# EasyEDA Pro project musclemap_pcb_header.eprj, board PCB1
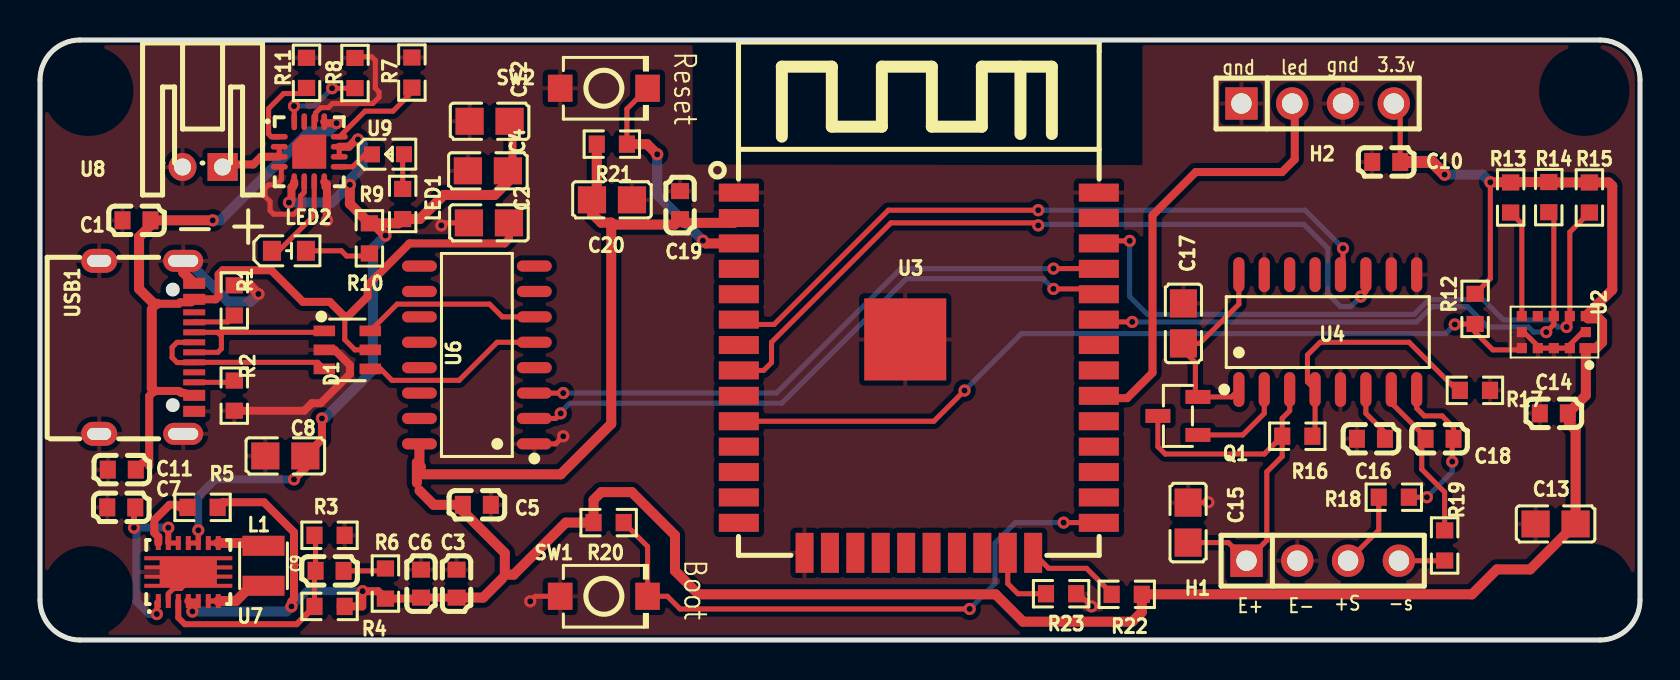
[diagram p5: board, top side]
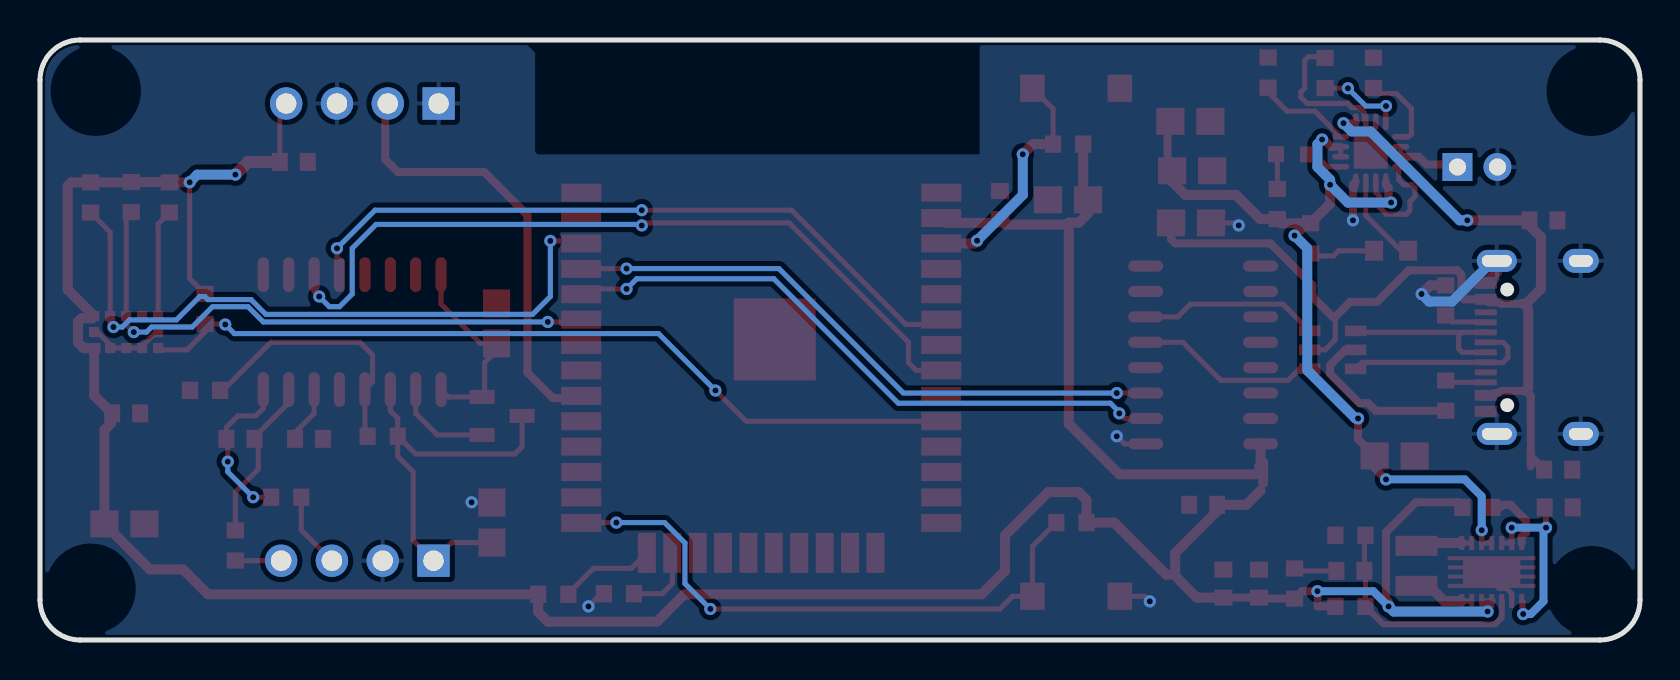
[diagram p6: board, bottom side, seen from below]

Outline 80 x 30 mm; copper layers: Top Layer, Bottom Layer. Coordinates in mm from the lower left corner of the outline.
Outline path: 0,28 0,2 arc(0.59,0.59) 2,0 78,0 arc(79.41,0.59) 80,2 80,28 arc(79.41,29.41) 78,30 2,30 arc(0.59,29.41) 0,28
Stack: Top Layer 0.035mm / Dielectric1 1.51mm FR4 er 4.5 / Bottom Layer 0.035mm

## Design rules (mm)
net D+_U: DP1
net D-_U: DP1
template: JLCPCB Capability(Two Layers Board)
spacing copperThickness1oz (default): track to track 0.102, other pairs 0.152 to 0.3
spacing copperThickness2oz: track to track 0.203, other pairs 0.152 to 0.3
track width copperThickness1oz (default): min 0.127, default 0.254, max 2.54
track width copperThickness2oz: min 0.203, default 0.254, max 2.54
differential pair differentialPair (default): width min 0.127, default 0.254, max 2.54; gap min 0.152, default 0.152
via viaSize (default): diameter min 0.5, default 0.61, max 10; hole min 0.3, default 0.305, max 6.3

## Placement (name value [footprint] x y rotation side)
C1  100nF  [C0603]  4.83 20.98 0 top
C2  10uF  [C0805]  22.45 20.86 0 top
C3  22uF  [C0603]  20.83 2.82 270 top
C4  10uF  [C0805]  22.4 23.46 180 top
C5  22uF  [C0603]  21.84 6.76 180 top
C6  22uF  [C0603]  19.05 2.82 270 top
C7  100nF  [C0603]  4.06 6.63 180 top
C8  10uF  [C0805]  12.27 9.2 180 top
C9  4.7pF  [C0603]  14.48 3.46 0 top
C10  100nF  [C0603]  67.31 23.9 180 top
C11  1uF  [C0603]  4.09 8.52 0 top
C12  4.7uF  [C0805]  22.48 25.94 0 top
C13  4.7uF  [C0805]  75.78 5.8 0 top
C14  100nF  [C0603]  75.69 11.33 0 top
C15  10uF  [C0805]  57.4 5.87 270 top
C16  100nF  [C0603]  66.55 10.06 180 top
C17  10uF  [C0805]  57.17 15.83 90 top
C18  100nF  [C0603]  69.98 10.06 0 top
C19  100nF  [C0603]  32 21.74 90 top
C20  10uF  [C0805]  28.6 22.01 0 top
D1  USBLC6-2SC6  [SOT-23-6_L2.9-W1.6-P0.95-LS2.8-BL]  15.37 14.51 270 top
H1  HX PH254-01-04-Z-L11.5 straight pin header  [HDR-TH_4P-HX-PH254-01-04-Z-L11.5]  64.13 3.97 0 top
H2  HX PH254-01-04-Z-L11.5 straight pin header  [HDR-TH_4P-HX-PH254-01-04-Z-L11.5]  63.88 26.83 0 top
L1  1.5uH  [IND-SMD_L2.5-W2.0_MEKK2520TR47M]  11.18 3.71 90 top
LED1  XL-1608SURC-06  [LED0603-RD_RED]  17.4 24.28 0 top
LED2  YLED0603B  [LED0603-FD]  12.45 19.46 180 top
Q1  BC807-40,215  [SOT-23-3_L2.9-W1.3-P1.90-LS2.4-BR]  56.9 11.2 0 top
R1  5.1kΩ  [R0603]  9.72 16.98 270 top
R2  5.1kΩ  [R0603]  9.71 12.22 90 top
R3  180kΩ  [R0603]  14.48 5.23 180 top
R4  1MΩ  [R0603]  14.48 1.68 0 top
R5  1MΩ  [R0603]  8.13 6.63 0 top
R6  68kΩ  [R0603]  17.27 2.82 270 top
R7  1.18kΩ  [R0603]  18.59 28.37 270 top
R8  1.13kΩ  [R0603]  15.75 28.35 270 top
R9  1kΩ  [R0603]  18.13 21.8 270 top
R10  1kΩ  [R0603]  16.47 20.08 90 top
R11  10kΩ  [R0603]  13.33 28.36 270 top
R12  3.6kΩ  [R0603]  71.75 16.56 90 top
R13  3.6kΩ  [R0603]  73.53 22.13 90 top
R14  3.6kΩ  [R0603]  75.44 22.14 90 top
R15  3.6kΩ  [R0603]  77.47 22.13 90 top
R16  20kΩ  [R0603]  62.87 10.19 180 top
R17  8.2kΩ  [R0603]  71.75 12.48 180 top
R18  100Ω  [R0603]  67.69 7.14 180 top
R19  100Ω  [R0603]  70.23 4.73 270 top
R20  10kΩ  [R0603]  28.43 5.87 180 top
R21  10kΩ  [R0603]  28.59 24.79 0 top
R22  10kΩ  [R0603]  54.34 2.28 0 top
R23  10kΩ  [R0603]  51.05 2.31 180 top
SW1  TS-1088-AR02016  [SW-SMD_L3.9-W3.0-P4.45]  28.19 2.19 0 top
SW2  TS-1088-AR02016  [SW-SMD_L3.9-W3.0-P4.45]  28.19 27.59 0 top
U2  VL53L4CDV0DH/1  [LGA-12_L4.4-W2.4_VL53L0X]  75.69 15.39 0 top
U3  ESP32-WROOM-32-N4  [WIFIM-SMD_ESP32-WROOM-32-N4]  43.94 13.36 0 top
U4  HX711  [SOP-16_L10.0-W3.9-P1.27-LS6.0-BL]  64.39 15.39 0 top
U6  CH340C  [SOP-16_L10.0-W3.9-P1.27-LS6.0-BL]  21.84 14.25 90 top
U7  TPS63020DSJT  [VSON-14_L4.0-W3.0-P0.50-BL-EP_TI_DSJ]  7.41 3.4 0 top
U8  S2B-PH-K-S(LF)(SN)  [CONN-TH_S2B-PH-K-S-LF-SN]  8.13 23.65 0 top
U9  BQ24075RGTR  [QFN-16_L3.0-W3.0-P0.50-TL-EP1.7]  13.46 24.41 0 top
USB1  TYPE-C 16PIN 2MD(073)  [USB-C-SMD_TYPE-C-6PIN-2MD-073]  5.33 14.63 270 top

## Footprints (pads in the part's own frame, mm; a bottom-side part is the same pattern mirrored in y, then rotated)
C0603
  rect 0.8x0.9 smd: 1(-0.7,0) 2(0.7,0)
C0805
  rect 1.41x1.35 smd: 1(-1,0) 2(1,0)
CONN-TH_S2B-PH-K-S-LF-SN
  rect 1.5x1.4 hole 0.85: 1(1,0)
  round 1.4 hole 0.85: 2(-1,0)
HDR-TH_4P-HX-PH254-01-04-Z-L11.5
  rect 1.62x1.62 hole 1.02: 1(-3.81,0)
  round 1.62 hole 1.02: 2(-1.27,0) 3(1.27,0) 4(3.81,0)
IND-SMD_L2.5-W2.0_MEKK2520TR47M
  rect 1x2.1 smd: 1(1,0) 2(-1,0)
LED0603-FD
  rect 0.9x1 smd: 1(-0.85,0) 2(0.85,0)
LED0603-RD_RED
  rect 0.8x0.8 smd: 1(-0.799,-0.004) 2(0.799,0.004)
LGA-12_L4.4-W2.4_VL53L0X
  custom 0.635x0.508 smd: 1(1.6,-0.8)
  rect 0.508x0.508 smd: 2(0.8,-0.8) 3(0,-0.8) 4(-0.8,-0.8) 5(-1.6,-0.8) 6(-1.6,0) 7(-1.6,0.8) 8(-0.8,0.8) 9(0,0.8) 10(0.8,0.8) 11(1.6,0.8) 12(1.6,0)
QFN-16_L3.0-W3.0-P0.50-TL-EP1.7
  oval 0.85x0.28 smd: 1(-1.5,0.75) 2(-1.5,0.25) 3(-1.5,-0.25) 4(-1.5,-0.75) 9(1.5,-0.75) 10(1.5,-0.25) 11(1.5,0.25) 12(1.5,0.75)
  oval 0.28x0.85 smd: 5(-0.75,-1.5) 6(-0.25,-1.5) 7(0.25,-1.5) 8(0.75,-1.5) 13(0.75,1.5) 14(0.25,1.5) 15(-0.25,1.5) 16(-0.75,1.5)
  custom 1.7x1.7 smd: 17(0,0)
R0603
  rect 0.806x0.864 smd: 1(-0.753,0) 2(0.753,0)
SOP-16_L10.0-W3.9-P1.27-LS6.0-BL
  oval 0.56x1.745 smd: 1(-4.445,-2.873) 2(-3.175,-2.873) 3(-1.905,-2.873) 4(-0.635,-2.873) 5(0.635,-2.873) 6(1.905,-2.873) 7(3.175,-2.873) 8(4.445,-2.873) 9(4.445,2.873) 10(3.175,2.873) 11(1.905,2.873) 12(0.635,2.873) 13(-0.635,2.873) 14(-1.905,2.873) 15(-3.175,2.873) 16(-4.445,2.873)
SOT-23-3_L2.9-W1.3-P1.90-LS2.4-BR
  rect 1.25x0.7 smd: 1(1,-0.95) 2(1,0.95) 3(-1,0)
SOT-23-6_L2.9-W1.6-P0.95-LS2.8-BL
  rect 0.532x1.072 smd: 1(-0.95,-1.149) 2(0,-1.149) 3(0.95,-1.149) 4(0.95,1.149) 5(0,1.149) 6(-0.95,1.149)
SW-SMD_L3.9-W3.0-P4.45
  rect 1.23x1.36 smd: 1(-2.185,0) 2(2.185,0)
USB-C-SMD_TYPE-C-6PIN-2MD-073
  rect 0.55x1.1 smd: 1(-3.2,2.375) 2(-2.4,2.375) 11(2.4,2.375) 12(3.2,2.375)
  rect 0.3x1.1 smd: 3(-1.75,2.375) 4(-1.25,2.375) 5(-0.75,2.375) 6(-0.25,2.375) 7(0.25,2.375) 8(0.75,2.375) 9(1.25,2.375) 10(1.75,2.375)
  oval 1.1x2 hole 0.6x1.5: 13(-4.325,1.825) 14(4.325,1.825)
  oval 1.2x1.8 hole 0.6x1.2: 13(-4.325,-2.375) 14(4.325,-2.375)
VSON-14_L4.0-W3.0-P0.50-BL-EP_TI_DSJ
  rect 0.25x0.7 smd: 1(-1.5,-1.45) 2(-1,-1.45) 3(-0.5,-1.45) 4(0,-1.45) 5(0.5,-1.45) 6(1,-1.45) 7(1.5,-1.45) 8(1.5,1.45) 9(1,1.45) 10(0.5,1.45) 11(0,1.45) 12(-0.5,1.45) 13(-1,1.45) 14(-1.5,1.45)
  custom 4.4x1.58 smd: 15(0,0)
WIFIM-SMD_ESP32-WROOM-32-N4
  rect 2x0.9 smd: 1(-9,9.005) 2(-9,7.735) 3(-9,6.465) 4(-9,5.195) 5(-9,3.925) 6(-9,2.655) 7(-9,1.385) 8(-9,0.115) 9(-9,-1.155) 10(-9,-2.425) 11(-9,-3.695) 12(-9,-4.965) 13(-9,-6.235) 14(-9,-7.505) 25(9,-7.505) 26(9,-6.235) 27(9,-4.965) 28(9,-3.695) 29(9,-2.425) 30(9,-1.155) 31(9,0.115) 32(9,1.385) 33(9,2.655) 34(9,3.925) 35(9,5.195) 36(9,6.465) 37(9,7.735) 38(9,9.005)
  rect 0.9x2 smd: 15(-5.715,-9.005) 16(-4.445,-9.005) 17(-3.175,-9.005) 18(-1.905,-9.005) 19(-0.635,-9.005) 20(0.635,-9.005) 21(1.905,-9.005) 22(3.175,-9.005) 23(4.445,-9.005) 24(5.715,-9.005)
  rect 4.1x4.1 smd: 39(-0.68,1.665)

## Nets
3.3V: C3.2 C5.2 C6.2 C10.1 C13.2 C14.2 C19.1 C20.1 H2.4 R4.2 R5.2 R6.2 R12.2 R13.2 R14.2 R15.2 R20.2 R21.1 R22.2 U2.1 U2.11 U3.2 U6.16 U7.4 U7.5
GND: C1.1 C2.1 C3.1 C4.2 C5.1 C6.1 C7.2 C8.2 C10.2 C11.1 C12.1 C13.1 C14.1 C15.1 C16.2 C17.2 C19.2 C20.2 D1.2 H1.2 H2.1 H2.3 R1.1 R2.1 R3.1 R7.1 R8.1 R11.1 R17.1 R23.1 SW1.1 SW2.1 U2.2 U2.3 U2.4 U2.6 U2.12 U3.1 U3.15 U3.38 U3.39 U4.5 U4.9 U4.10 U4.15 U6.1 U7.2 U7.15 U8.2 U9.4 U9.6 U9.8 U9.14 USB1.1 USB1.12 USB1.13 USB1.14
VBUS: C1.2 C2.2 C11.2 D1.5 U9.13 USB1.2 USB1.11
32: U3.8 U4.11
34: U3.6 U4.12
D+: D1.3 USB1.6 USB1.8
D+_U: D1.4 U6.5
D-: D1.1 USB1.5 USB1.7
D-_U: D1.6 U6.6
RX: U3.34 U6.2
SCL: R15.1 U2.10 U3.36
SDA: R14.1 U2.9 U3.33
TX: U3.35 U6.3
VOUT: C4.1 C8.1 C12.2 R9.2 R10.2 U7.10 U7.11 U9.5 U9.10 U9.11
XSHUT: R12.1 U2.5 U3.10
$1N1499: R1.2 USB1.4
$1N1538: R2.2 USB1.10
$1N2804: L1.1 U7.8 U7.9
$1N2809: L1.2 U7.6 U7.7
$1N2919: R5.1 U7.14
$1N3098: C7.1 U7.1 U7.12 U7.13
$1N3230: C9.1 R3.2 R4.1 U7.3
$1N3482: C9.2 R6.1
$1N4163: R7.2 U9.12
$1N4202: R8.2 U9.16
$1N4584: LED1.1 U9.9
$1N4586: LED1.2 R9.1
$1N4675: LED2.2 U9.7
$1N4721: LED2.1 R10.1
$1N4792: R11.2 U9.1
$1N4858: U8.1 U9.2 U9.3
$1N5175: R13.1 U2.7
$1N5467: C17.1 Q1.2 U4.1 U4.16
$1N5724: R16.1 R17.2 U4.4
$1N5741: Q1.1 U4.2
$1N5746: C15.2 H1.1 Q1.3 R16.2 U4.3
$1N5829: C16.1 U4.6
$1N6086: C18.2 R18.1 U4.8
$1N6088: C18.1 R19.1 U4.7
$1N6257: H1.3 R18.2
$1N6263: H1.4 R19.2
$1N6579: R20.1 SW1.2 U3.25
$1N6780: R21.2 SW2.2 U3.3
$1N6891: R22.1 U3.24
$1N6937: R23.2 U3.23
$1N7024: H2.2 U3.30

Pads without a net: U2 8; U3 4 5 7 9 11 12 13 14 16 17 18 19 20 21 22 26 27 28 29 31 32 37; U4 13 14; U6 4 7 8 9 10 11 12 13 14 15; U9 15 17; USB1 3 9

## Via types
v1: diameter 0.61, hole 0.305, Top Layer to Bottom Layer, 46 vias

## Routing (per net, layer and track width the routed paths; a pad name or vN(x,y) marks a point on that pad's centre or on a via; arc(x,y) is an arc through that point)
3.3V: length 170.7
  Top Layer w0.254: U7.5 U7.4 ; v1(72.52,22.89) 72.52,18.07 R12.2 ; H2.4 68.01,26.51 C10.1 ; 14.95,1.68 R4.2
  Top Layer w0.4: v1(7.62,1.42) 7.62,1.74 U7.4 ; R4.2 16.11,1.68 16.11,2.43 v1(16.13,2.44) 16.9,2.44 R6.2 19,2.07 C6.2 C3.2 ; R5.2 9.14,6.89 11.2,6.89 12.7,5.39 12.7,2.06 12.57,1.93 v1(12.57,1.68)
  Top Layer w0.5: 18.97,8.74 18.97,8.49 ; 18.97,8.74 19.05,8.66 ; 18.97,8.74 18.84,8.87 18.84,7.85 ; 18.97,8.74 U6.16 ; 28.56,20.87 28.56,10.81 26.03,8.28 19.18,8.28 ; 28.56,20.87 28.66,20.77 31.73,20.77 C19.1 32.19,20.86 34.7,20.86 U3.2 ; 28.56,20.87 28.05,20.87 27.6,21.33 C20.1 27.84,22.25 R21.1 ; C3.2 22.16,2.12 23.11,3.08 ; v1(72.52,22.89) 73.52,22.89 R13.2 73.55,22.9 75.44,22.9 75.46,22.88 R15.2 78.43,22.88 78.61,22.7 78.61,17.52 U2.11 77.4,16.08 77.93,16.08 78.1,15.9 78.1,14.89 77.81,14.59 U2.1 77.29,12.23 C14.2 76.45,11.27 76.45,10.82 76.78,10.5 C13.2 74.51,3.53 72.84,3.53 71.6,2.28 R22.2 55.09,1.4 54.61,0.92 49.15,0.92 47.78,2.28 32.92,2.28 31.75,3.46 31.75,5.23 29.59,7.39 28.07,7.39 27.68,7 27.68,5.87 26.29,5.87 23.69,3.27 23.24,3.27 23.24,4.35 21.14,6.44 C5.2 19.69,6.76 18.97,7.47
  Top Layer w0.6: v1(70.23,23.27) 69.6,23.9 C10.1
  Bottom Layer w0.4: v1(16.13,2.44) 13.34,2.44 v1(12.57,1.68)
  Bottom Layer w0.5: v1(70.23,23.27) 72.14,23.27 v1(72.52,22.89) ; v1(7.62,1.42) 12.32,1.42 v1(12.57,1.68)
GND: length 43.9
  Top Layer w0.254: U7.15 7.41,2.95 7.04,2.58 6.67,2.58 6.41,2.32 U7.2 ; U9.6 13.21,22.91 13.21,22.38 13.03,22.2 13.03,21.63 12.69,21.29 11.68,21.29 11.5,21.47 11.5,21.92 11.25,22.18 11.25,22.58 11.43,22.76 11.81,22.76 12.06,23.02 12.06,23.56 U9.4 ; C2.1 20.19,20.86 v1(20.07,20.73) ; R8.1 15.81,29.16 16.58,29.16 16.76,28.98 16.76,27.59 16.95,27.4 16.95,27.14 16.64,26.83 14.62,26.83 14.42,26.62 14.04,26.62 13.78,26.36 13.78,25.98 U9.14 ; v1(24.51,1.93) 24.77,2.19 SW1.1 ; R23.1 51.94,2.31 v1(52.58,1.68) ; U6.1 25.78,9.81 v1(26.16,10.19) ; v1(58.42,6.89) 58.4,6.87 C15.1 ; U2.6 74.19,15.39 74.93,14.66 74.93,14.63 U2.4 U2.3 U2.2 76.49,14.76 77.13,15.39 U2.12
  Top Layer w0.4: R2.1 13.21,11.46 13.59,11.84 14.03,11.84 15.49,13.3 15.49,13.74 14.73,14.51 D1.2 ; v1(14.35,20.98) 14.35,22.77 U9.8
  Top Layer w0.5: USB1.13 7.16,18.38 USB1.1 ; v1(10.92,17.3) 10.49,17.73 R1.1
  Bottom Layer w0.5: v1(10.92,17.3) 10.54,16.92 9.4,16.92 7.36,18.96 USB1.13
VBUS: length 53.2
  Top Layer w0.254: 15.24,16.16 15.24,15.01 15.75,14.51 D1.5
  Top Layer w0.4: U9.13 14.28,25.84 v1(14.83,25.84) ; C2.2 23.45,20.05 23.23,19.83 18.47,19.83 16.38,17.74 16.38,17.17 15.37,16.16 15.24,16.16 14.49,16.91 13.14,16.91 11.56,18.49 9.14,18.49 8.93,18.28 8.93,17.18 8.78,17.03 USB1.2 7.56,16.88 7.01,16.88 6.94,16.81 5.86,16.81 5.59,16.54 ; USB1.11 7.7,12.22 7.37,12.22 7.24,12.35 7.11,12.35 7.08,12.38 7.01,12.38 6.94,12.45 5.72,12.45 5.46,12.2 5.46,8.68 ; C11.2 5.33,9.06
  Top Layer w0.5: 5.59,16.54 5.59,12.58 5.72,12.45 ; v1(8.64,20.98) 5.78,20.98 4.95,20.15 4.95,17.55 5.7,16.81 5.86,16.81
  Bottom Layer w0.5: v1(8.64,20.98) 9.02,20.98 13.46,25.43 14.41,25.43 v1(14.83,25.84)
32: length 39.3
  Top Layer w0.254: U4.11 66.29,17.43 v1(66.04,17.17) ; v1(49.91,20.73) 49.78,20.86 42.55,20.86 36.58,14.89 36.58,13.87 36.18,13.48 U3.8
  Bottom Layer w0.254: v1(49.91,20.73) 49.96,20.78 63.19,20.78 64.39,19.59 64.39,17.3 65.02,16.66 65.53,16.66 v1(66.04,17.17)
34: length 34.8
  Top Layer w0.254: U4.12 65.15,18.39 v1(65.15,19.59) ; v1(49.91,21.49) 42.42,21.49 36.7,15.78 35.18,15.78 U3.6
  Bottom Layer w0.254: v1(49.91,21.49) 63.25,21.49 v1(65.15,19.59)
D+: length 9.6
  Top Layer w0.254: D1.3 13.89,13.88 USB1.8 7.7,13.87 6.86,13.87 6.6,14.12 6.6,14.63 6.85,14.88 USB1.6
D+_U: length 9.2
  Top Layer w0.254: D1.4 17.02,13.56 17.6,12.98 20.96,12.98 22.86,14.89 U6.5
D-: length 8.9
  Top Layer w0.254: USB1.5 8.88,15.38 ; 8.88,15.38 9.07,15.19 9.07,14.56 8.89,14.38 USB1.7 ; 8.88,15.38 14.14,15.38 D1.1
D-_U: length 9
  Top Layer w0.254: U6.6 23.11,16.16 22.48,16.79 17.85,16.79 D1.6
RX: length 31.5
  Top Layer w0.254: U6.2 25.78,11.08 v1(26.03,11.33) ; v1(50.67,17.55) 52.68,17.55 U3.34
  Bottom Layer w0.254: v1(50.67,17.55) 50.16,18.06 43.31,18.06 37.08,11.84 26.48,11.84 26.03,11.39 v1(26.03,11.33)
SCL: length 33.8
  Top Layer w0.254: v1(54.48,19.95) 53.07,19.95 U3.36 ; v1(76.33,15.65) 76.49,15.81 U2.10 76.49,20.39 R15.1
  Bottom Layer w0.254: v1(76.33,15.65) 75.88,15.65 75.53,16 73.18,16 72.01,17.17 71.75,17.17 71.6,17.02 69.45,17.02 68.71,16.28 55.37,16.28 54.48,17.17 v1(54.48,19.95)
SDA: length 29.5
  Top Layer w0.254: v1(54.61,15.9) 53.06,15.9 U3.33 ; v1(75.31,15.39) 75.69,15.78 U2.9 75.69,21.14 R14.1
  Bottom Layer w0.254: v1(75.31,15.39) 74.68,15.39 74.42,15.65 72.39,15.65 71.37,16.66 69.6,16.66 68.83,15.9 v1(54.61,15.9)
TX: length 30.8
  Top Layer w0.254: U3.35 52.93,18.57 v1(50.67,18.57) ; U6.3 v1(26.16,12.35)
  Bottom Layer w0.254: v1(50.67,18.57) 43.05,18.57 36.83,12.35 v1(26.16,12.35)
VOUT: length 45.1
  Top Layer w0.254: U9.10 U9.11 ; U7.11 U7.10 v1(7.91,5.49) ; R10.2 16.66,20.83
  Top Layer w0.4: v1(14.1,11.08) 14.1,10.03 C8.1 13.27,8.6 v1(12.7,8.03) ; v1(12.45,21.87) 12.57,22 12.57,22.65 12.71,22.78 U9.5 ; 23.35,25.81 23.62,25.81 23.62,23.69 C4.1 ; U9.11 15.44,24.66 15.74,24.96 15.83,24.96 v1(15.9,25.03)
  Top Layer w0.5: v1(15.49,22.76) 15.49,21.81 R10.2 ; v1(17.27,20.22) 16.66,20.83 17.92,20.83 R9.2 18.99,21.05 20.19,22.25 22.73,22.25 23.4,22.91 C4.1
  Bottom Layer w0.4: v1(12.7,8.03) 8.76,8.03 7.91,7.18 v1(7.91,5.49)
  Bottom Layer w0.5: v1(15.9,25.03) 16.13,24.79 16.13,23.65 15.49,23.02 v1(15.49,22.76) 14.61,21.87 v1(12.45,21.87) ; v1(14.1,11.08) 14.22,11.08 16.64,13.49 16.64,19.59 v1(17.27,20.22)
XSHUT: length 42
  Top Layer w0.254: U2.5 74,14.51 72.64,14.51 71.75,15.39 R12.1 70.77,15.8 v1(70.74,15.78) ; U3.10 44.69,10.94 v1(46.23,12.47)
  Bottom Layer w0.254: v1(70.74,15.78) 70.28,15.32 49.07,15.32 v1(46.23,12.47)
$1N1499: length 2.1
  Top Layer w0.254: R1.2 9.39,15.9 7.73,15.9 USB1.4
$1N1538: length 2
  Top Layer w0.254: R2.2 9.63,12.88 USB1.10
$1N2804: length 2.8
  Top Layer w0.254: U7.9 U7.8
  Top Layer w0.5: L1.1 11.04,4.85 U7.8
$1N2809: length 3.1
  Top Layer w0.254: U7.6 U7.7
  Top Layer w0.5: L1.2 11.05,2.58 10.43,2.58 9.79,1.95 U7.7
$1N2919: length 3.3
  Top Layer w0.4: R5.1 6.99,6.63 6.87,6.76 6.48,6.76 5.72,6 5.72,5.36 5.91,5.16 U7.14
$1N3098: length 9.7
  Top Layer w0.254: U7.1 5.84,1.88 v1(5.84,1.3) ; U7.12 U7.13
  Top Layer w0.3: C7.1 4.7,6.57 v1(4.7,5.62) ; U7.13 v1(6.41,5.62)
  Bottom Layer w0.4: v1(5.84,1.3) 5.46,1.3 4.83,1.93 4.83,5.49 v1(4.7,5.62) v1(6.41,5.62)
$1N3230: length 11.7
  Top Layer w0.254: R4.1 13.72,3.4 C9.1 13.78,5.18 R3.2
  Top Layer w0.3: R4.1 12.84,0.79 7.24,0.79 6.91,1.11 U7.3
$1N3482: length 2.1
  Top Layer w0.254: R6.1 17.15,3.46 C9.2
$1N4163: length 4.8
  Top Layer w0.254: R7.2 18.59,27.39 17.65,26.44 16.26,26.44 14.97,25.16 U9.12
$1N4202: length 4.2
  Top Layer w0.254: U9.16 12.71,26.69 v1(12.7,26.7) ; v1(14.61,27.59) 15.74,27.59 R8.2
  Bottom Layer w0.254: v1(12.7,26.7) 13.72,26.7 v1(14.61,27.59)
$1N4584: length 1.9
  Top Layer w0.254: LED1.1 16.25,24.28 15.63,23.66 U9.9
$1N4586: length 1.8
  Top Layer w0.254: LED1.2 18.13,24.22 R9.1
$1N4675: length 4.5
  Top Layer w0.254: U9.7 13.71,21.23 11.94,19.46 LED2.2
$1N4721: length 3.3
  Top Layer w0.254: R10.1 16.34,19.2 15.33,19.2 15.07,19.46 LED2.1
$1N4792: length 4.3
  Top Layer w0.254: U9.1 11.57,25.16 11.43,25.3 11.43,26.57 12.18,27.32 13.33,27.32 R11.2
$1N4858: length 3.6
  Top Layer w0.254: U9.3 U9.2
  Top Layer w0.4: 9,23.78 10.67,23.78 11.05,24.16 U9.3
$1N5175: length 5.4
  Top Layer w0.254: R13.1 74.09,20.81 U2.7
$1N5467: length 10.2
  Top Layer w0.254: U4.16 59.94,16.79 57.98,14.83 C17.1 57.17,14.47 57.77,13.87 57.77,12.28 Q1.2 59.58,12.15 U4.1
$1N5724: length 13.3
  Top Layer w0.254: 70.87,12.23 70.87,12.47 68.45,14.89 64.01,14.89 63.37,14.25 63.37,12.9 U4.4 63.75,10.32 R16.1
$1N5741: length 5
  Top Layer w0.254: Q1.1 60.14,10.25 61.21,11.33 U4.2
$1N5746: length 21
  Top Layer w0.254: Q1.3 55.9,9.66 56.26,9.3 61.21,9.3 62.1,10.19 R16.2 ; R16.2 62.11,9.18 61.34,8.41 61.34,4.98 H1.1 59.42,4.87 C15.2 ; R16.2 62.11,11.09 62.48,11.46 U4.3
$1N5829: length 2.9
  Top Layer w0.254: C16.1 67.25,10.38 66.29,11.33 U4.6
$1N6086: length 8.3
  Top Layer w0.254: v1(70.61,8.92) 70.61,10.2 70.68,10.27 ; 70.68,10.27 C18.2 ; 70.68,10.27 70.68,10.63 70.1,11.2 69.22,11.2 68.83,11.58 U4.8 ; R18.1 v1(69.34,7.14)
  Bottom Layer w0.254: v1(69.34,7.14) 70.61,8.41 v1(70.61,8.92)
$1N6088: length 8.3
  Top Layer w0.254: R19.1 70.23,7.39 69.09,8.54 69.09,9.87 C18.1 69.28,10.15 67.69,11.73 67.69,12.4 U4.7
$1N6257: length 3.8
  Top Layer w0.254: H1.3 66.94,5.5 R18.2
$1N6263: length 2.3
  Top Layer w0.254: R19.2 70.22,3.97 H1.4
$1N6579: length 30
  Top Layer w0.254: v1(51.18,5.87) 52.93,5.87 U3.25 ; v1(46.48,1.55) 32,1.55 31.37,2.19 SW1.2 30.38,4.67 R20.1
  Bottom Layer w0.254: v1(46.48,1.55) 47.75,2.82 47.75,4.85 48.77,5.87 v1(51.18,5.87)
$1N6780: length 12.1
  Top Layer w0.254: SW2.2 29.35,26.55 R21.2
  Top Layer w0.5: R21.2 30.35,24.79 v1(30.86,24.28) ; U3.3 33.29,19.83 v1(33.15,19.97)
  Bottom Layer w0.5: v1(30.86,24.28) 30.86,22.25 v1(33.15,19.97)
$1N6891: length 4.8
  Top Layer w0.254: R22.1 53.58,2.33 52.32,3.58 50.43,3.58 U3.24
$1N6937: length 3.7
  Top Layer w0.254: R23.2 48.9,2.31 48.39,2.82 U3.23
$1N7024: length 22.2
  Top Layer w0.4: U3.30 53.06,12.09 54.36,12.09 55.63,13.36 55.63,21.24 57.78,23.4 62.1,23.4 62.74,24.03 62.74,26.7 H2.2

## Copper pours and planes (outline as drawn; the poured copper is in the pictures)
GND on Top Layer: -1.52,32.67 -1.52,-1.37 -0.43,-2.39 82.8,-2.39 84.45,-0.59 84.08,31.27 83.31,32.03 58.29,32.03 55.12,30.73 55.12,23.75 32.77,23.78 32.64,23.9 32.64,31.57 32.26,31.91 -0.76,31.91
GND on Top Layer: 12.19,30.63 12.19,26.7 12.67,26.23 17.19,26.23 17.27,26.32 17.27,30.38 17.02,30.63
GND on Bottom Layer: -1.78,31.14 -1.78,-2.55 81.41,-2.39 81.41,30.38 81.15,30.63 56.52,30.63 55.25,29.36 55.25,24.41 55.12,24.28 33.02,24.28 33.02,30.25 32.38,30.89 -1.52,30.89
GND on Bottom Layer: 18.16,5.74 18.16,3.1 22.03,3.1 22.03,4.79 21.08,5.74

## Text on the board
Top Silkscreen Layer: gnd | E+ | led | E- | +S | 3.3v | -s | Reset | Boot | - | +
